# EAGLE design converter (EAGLE 9.6.0)
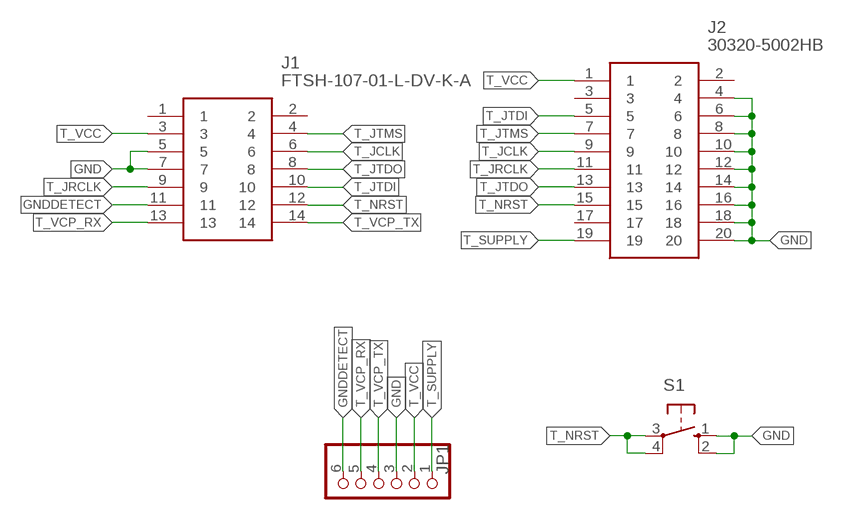
[diagram p0: schematic, sheet 1]

## Parts
J1  FTSH-107-01-L-DV-K-A  [FTSH10701LDVKA]
J2  30320-5002HB  [303205002HB]
JP1  PINHD-1X6  [1X06]
S1  10-XX  [B3F-10XX]

## Nets
GND: J1.5 J1.7 J2.4 J2.6 J2.8 J2.10 J2.12 J2.14 J2.16 J2.18 J2.20 JP1.3 S1.1(S) S1.2(S1)
GNDDETECT: J1.11 JP1.6
T_JCLK: J1.6 J2.9
T_JRCLK: J1.9 J2.11
T_JTDI: J1.10 J2.5
T_JTDO: J1.8 J2.13
T_JTMS: J1.4 J2.7
T_NRST: J1.12 J2.15 S1.3(P) S1.4(P1)
T_SUPPLY: J2.19 JP1.1
T_VCC: J1.3 J2.1 JP1.2
T_VCP_RX: J1.13 JP1.5
T_VCP_TX: J1.14 JP1.4
Unconnected: J1.1 J1.2 J2.2 J2.3 J2.17

## Library data of the parts
J1 = SamacSys_Parts:FTSH-107-01-L-DV-K-A: Headers & Wire Housings .050" Micro Terminal Strip Source: Datasheet <http://suddendocs.samtec.com/prints/ftsh-1xx-xx-xxx-dv-xxx-xxx-mkt.pdf>; DESCRIPTION: Headers & Wire Housings .050" Micro Terminal Strip; HEIGHT: 5.97mm; MANUFACTURER_NAME: SAMTEC; MANUFACTURER_PART_NUMBER: FTSH-107-01-L-DV-K-A; MOUSER_PART_NUMBER: 200-FTSH10701LDVKA; MOUSER_PRICE-STOCK: https://www.mouser.co.uk/ProductDetail/Samtec/FTSH-107-01-L-DV-K-A?qs=PB6%2FjmICvI3xEHFou4PhNg%3D%3D
J2 = SamacSys_Parts:30320-5002HB: Conn Shrouded Header HDR 20 POS 2.54mm Solder RA Thru-Hole Source: Datasheet; DESCRIPTION: Conn Shrouded Header HDR 20 POS 2.54mm Solder RA Thru-Hole; HEIGHT: 8.78mm; MANUFACTURER_NAME: 3M; MANUFACTURER_PART_NUMBER: 30320-5002HB; MOUSER_PART_NUMBER: 517-30320-5002; MOUSER_PRICE-STOCK: https://www.mouser.co.uk/ProductDetail/3M-Electronic-Solutions-Division/30320-5002HB?qs=IOh0O5QtZ908woepeDJGsw%3D%3D
JP1 = pinhead:PINHD-1X6: PIN HEADER
S1 = switch-omron:10-XX: OMRON SWITCH; MPN: B3F-1000; OC_FARNELL: 176432; OC_NEWARK: 36M3542

## Board
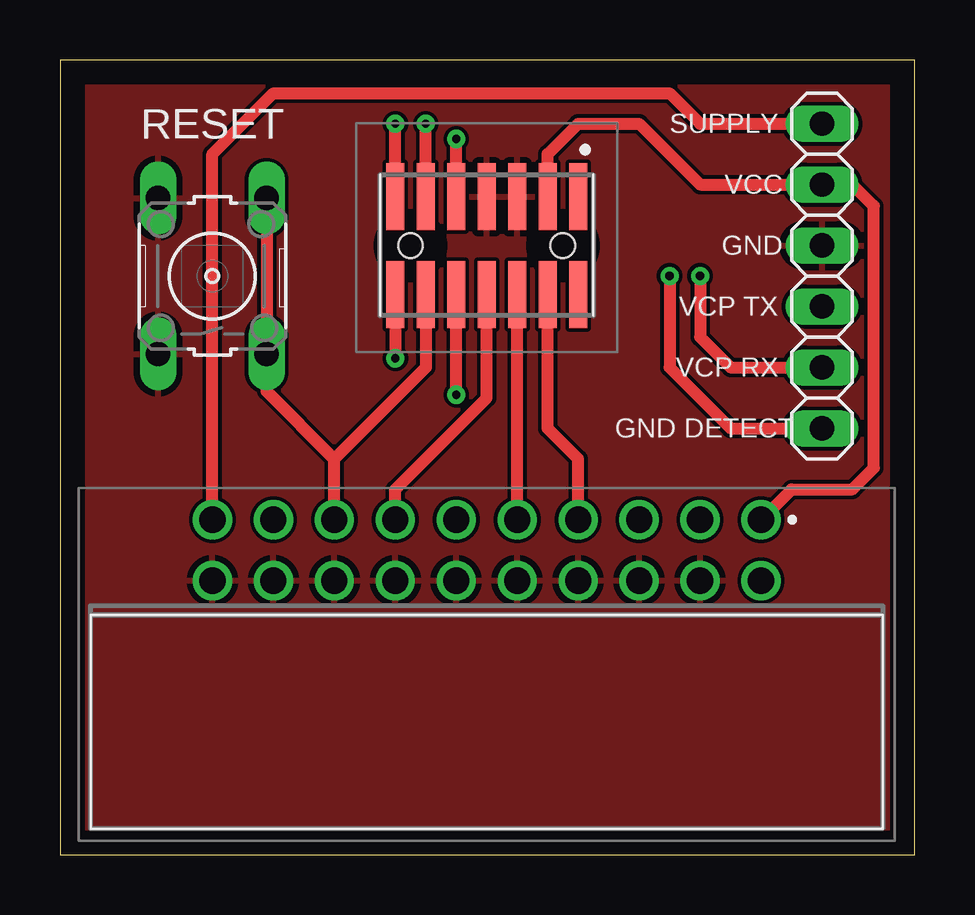
[diagram p1: board, top side]
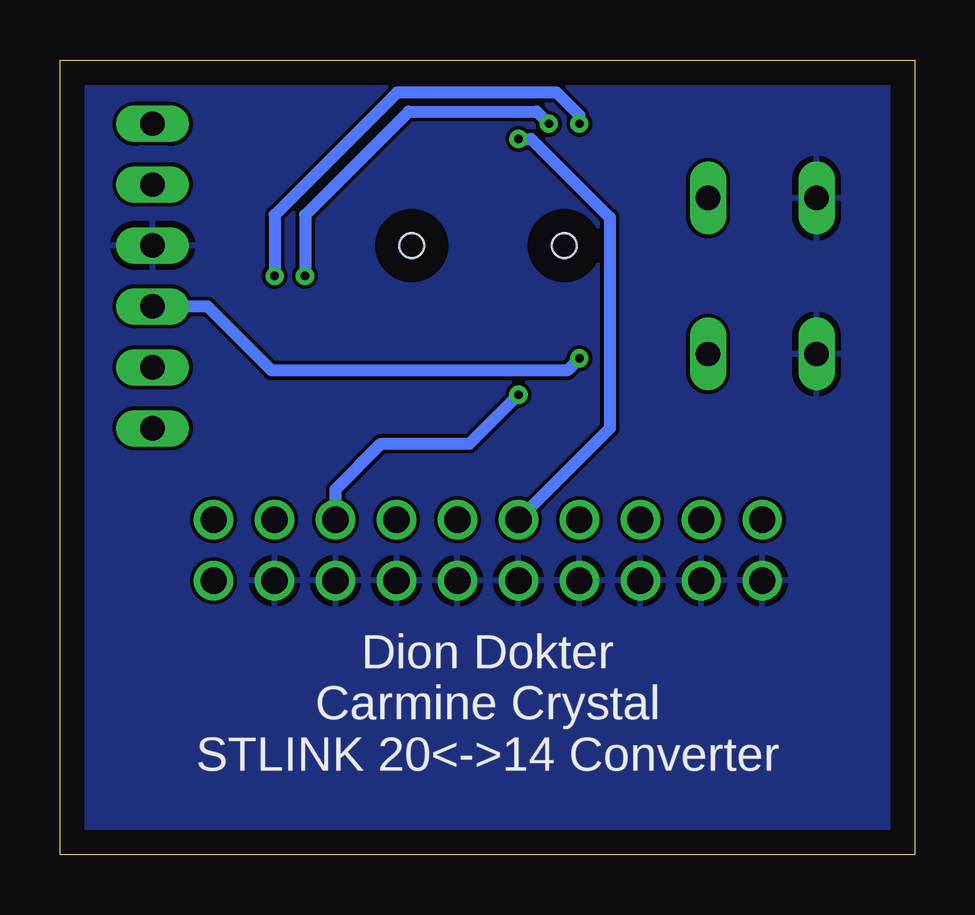
[diagram p2: board, bottom side, seen from below]

Size 35.61 x 33.14 mm. Coordinates in mm from the lower left corner, seen from the top.
Outline: 0,0 35.61,0 35.61,33.14 0,33.14 0,0
Copper layers (1*16): Top 0.035mm / dielectric 1.5mm / Bottom 0.035mm
Design rules "default *": minimum track width 6mil, minimum drill 0.35mm, track to track 6mil, track to pad 6mil, pad to pad 6mil, via to via 6mil, smd to smd 6mil, copper to edge 40mil, drill to drill 6mil, minimum pad ring 10mil, minimum via ring 8mil, stop-mask expansion 4mil, vias tented up to drill 0.36mm, thermal gap 10mil

### Footprints (pad centres in the part's own frame; a part is rotated, then mirrored left to right if it is on the bottom)
FTSH10701LDVKA = smd 0.74 x 2.79: 1 -3.81,-2.035; 2 -3.81,2.035; 3 -2.54,-2.035; 4 -2.54,2.035; 5 -1.27,-2.035; 6 -1.27,2.035; 7 0,-2.035; 8 0,2.035; 9 1.27,-2.035; 10 1.27,2.035; 11 2.54,-2.035; 12 2.54,2.035; 13 3.81,-2.035; 14 3.81,2.035 | hole 1.02: -3.175,0; 3.175,0
303205002HB = drill 1.092 pad 1.638: 1 0,0; 2 0,2.54; 3 2.54,0; 4 2.54,2.54; 5 5.08,0; 6 5.08,2.54; 7 7.62,0; 8 7.62,2.54; 9 10.16,0; 10 10.16,2.54; 11 12.7,0; 12 12.7,2.54; 13 15.24,0; 14 15.24,2.54; 15 17.78,0; 16 17.78,2.54; 17 20.32,0; 18 20.32,2.54; 19 22.86,0; 20 22.86,2.54
1X06 = drill 1.016 long: 1 -6.35,0; 2 -3.81,0; 3 -1.27,0; 4 1.27,0; 5 3.81,0; 6 6.35,0
B3F-10XX = drill 1.016 long: 1 -3.251,2.261; 2 3.251,2.261; 3 -3.251,-2.261; 4 3.251,-2.261

### Placement (x,y rotation side)
J1  17.78,25.4 180 top
J2  29.21,13.97 180 top
JP1  31.75,24.13 270 top
S1  6.35,24.13 90 top

### Tracks (layer width: path | path; a pad name or v marks a point on that pad's centre or on a via)
GND
  pour Top: 0,33.02 35.56,33.02 35.56,0 0,0
  pour Bottom: 0,33.02 35.56,33.02 35.56,0 0,0
GNDDETECT  (via drill 0.35)
  Top 0.508: J1.11 v15.24,30.48 | v25.4,24.13 25.4,20.32 27.94,17.78 JP1.6
  Bottom 0.508: v15.24,30.48 15.75,30.99 21.08,30.99 25.4,26.67 v25.4,24.13
T_JCLK
  Top 0.508: J2.9 J1.6
T_JRCLK  (via drill 0.35)
  Top 0.508: J1.9 v16.51,29.84
  Bottom 0.508: J2.11 12.7,17.78 12.7,26.57 15.98,29.84 v16.51,29.84
T_JTDI  (via drill 0.35)
  Top 0.508: v16.51,19.18 J1.10
  Bottom 0.508: J2.5 24.13,15.24 22.23,17.14 18.54,17.14 v16.51,19.18
T_JTDO
  Top 0.508: J2.13 13.97,15.24 17.78,19.05 J1.8
T_JTMS
  Top 0.508: J2.7 21.59,16.51 20.32,17.78 J1.4
T_NRST
  Top 0.508: S1.4 S1.3 8.61,19.33 11.43,16.51 | J1.12 15.24,20.32 11.43,16.51 | J2.15 11.43,16.51
T_SUPPLY
  Top 0.508: J2.19 6.35,29.21 8.89,31.75 25.4,31.75 26.67,30.48 JP1.1
T_VCC
  Top 0.508: J1.3 20.32,29.21 21.59,30.48 24.13,30.48 26.67,27.94 JP1.2 33.02,27.94 33.91,27.05 33.91,16.13 33.02,15.24 30.48,15.24 J2.1
T_VCP_RX  (via drill 0.35)
  Top 0.508: J1.13 v13.97,30.48 | v26.67,24.13 26.67,21.59 27.94,20.32 JP1.5
  Bottom 0.508: v13.97,30.48 13.97,30.83 14.91,31.77 21.57,31.77 26.67,26.67 v26.67,24.13
T_VCP_TX  (via drill 0.35)
  Top 0.508: J1.14 v13.97,20.7
  Bottom 0.508: v13.97,20.7 14.48,20.19 26.8,20.19 29.46,22.86 JP1.4

### Text on the board
tNames: RESET | SUPPLY | VCC | GND | VCP TX | VCP RX | GND DETECT
bNames: Dion Dokter / Carmine Crystal / STLINK 20<->14 Converter